# Altium schematic sheet POWER.SchDoc
size 299 x 210 mm; PageSetup: Record=PageOptions|CenterHorizontal=True|CenterVertical=True|PrintScale=0.94|XCorrection=0.00|YCorrection=0.00|PrintKind=0|BorderSize=5000000|LeftOffset=0|BottomOffset=0|Orientation=2|PaperLength=1000|PaperWidth=1000|Scale=100|PaperSource=15|PrintQuality=600|MediaType=1|DitherType=10|PrintScaleMode=1|PaperKind=A4; Adr1: August Barks gata 6B; Adr2: SE-421 32 Västra Frölunda; Adr3: Sweden; Webpage: www.omnisys.se
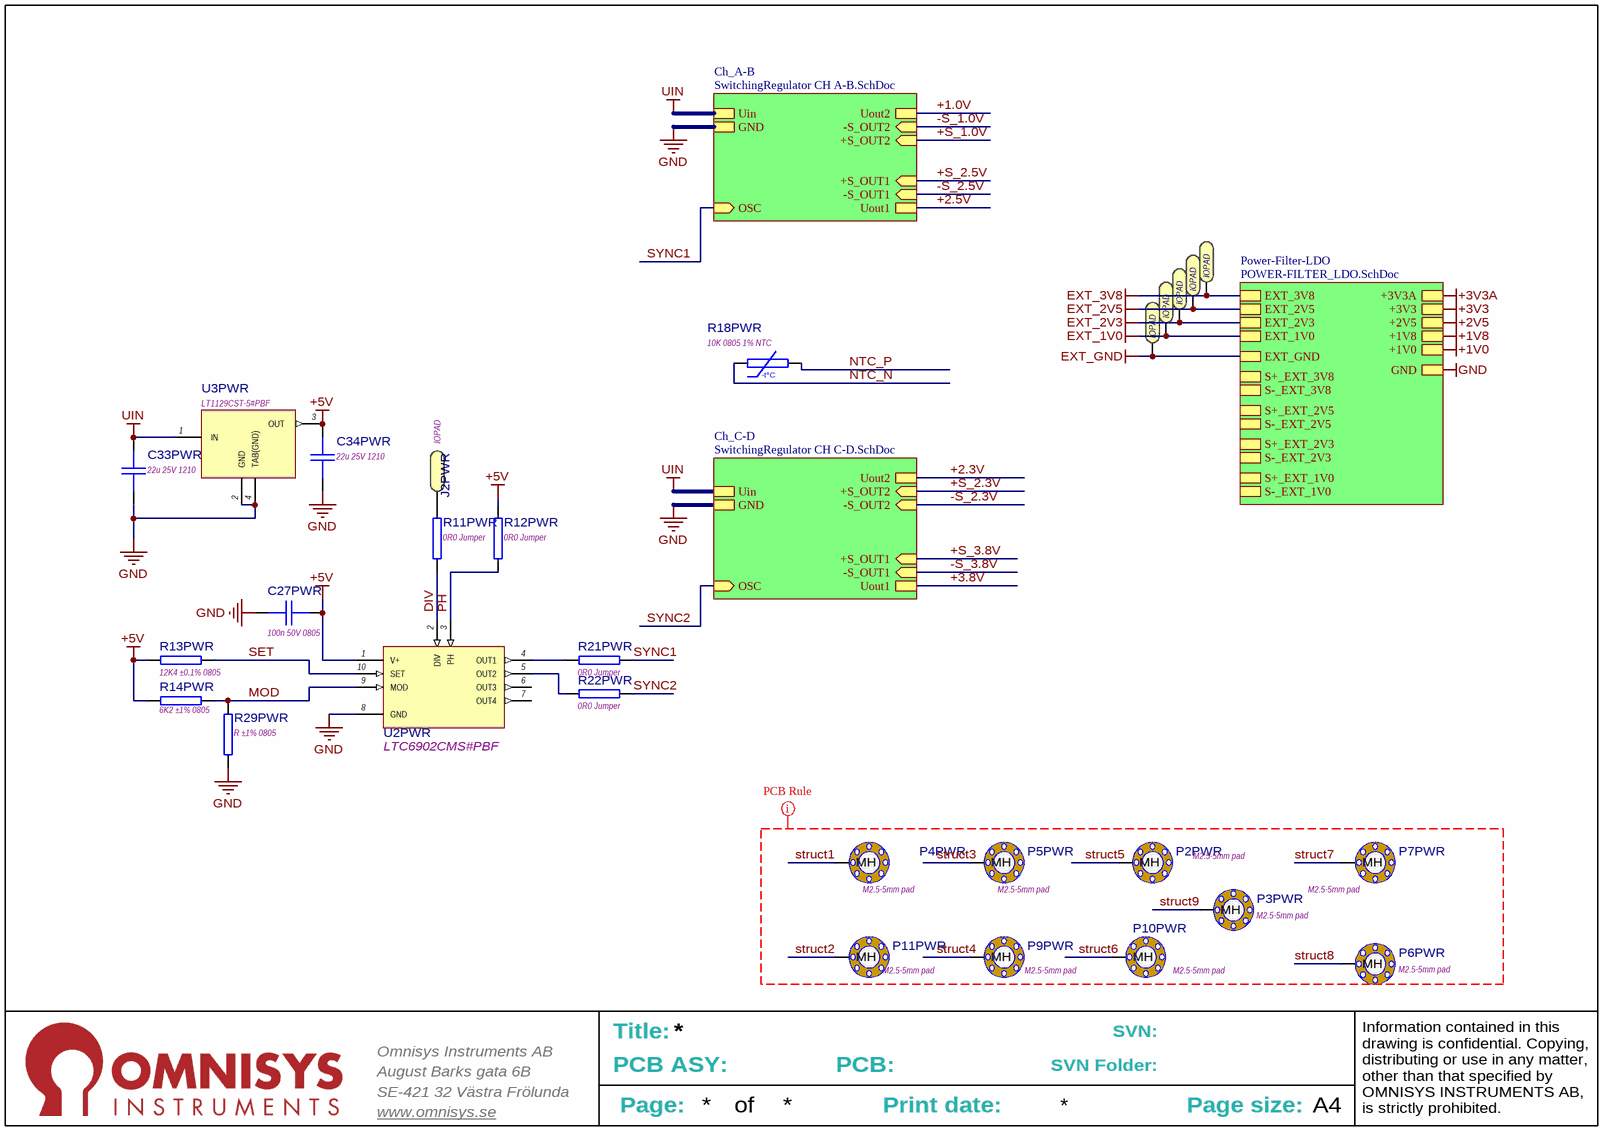
[diagram p0: POWER.SchDoc]

## Parts
C27PWR  100n 50V 0805  [CAPC2012X135N]
C33PWR  22u 25V 1210  [CAPC3225X270N]
C34PWR  22u 25V 1210  [CAPC3225X270N]
J2PWR  IOPAD  [SMT_IO_PAD_2x1MM]  (no BOM)
J16  IOPAD  [SMT_IO_PAD_2x1MM]  (no BOM)
J17  IOPAD  [SMT_IO_PAD_2x1MM]  (no BOM)
J18  IOPAD  [SMT_IO_PAD_2x1MM]  (no BOM)
J19  IOPAD  [SMT_IO_PAD_2x1MM]  (no BOM)
J20  IOPAD  [SMT_IO_PAD_2x1MM]  (no BOM)
P2PWR  M2.5-5mm pad  [MH5-2_7MM]  (no BOM)
P3PWR  M2.5-5mm pad  [MH5-2_7MM]  (no BOM)
P4PWR  M2.5-5mm pad  [MH5-2_7MM]  (no BOM)
P5PWR  M2.5-5mm pad  [MH5-2_7MM]  (no BOM)
P6PWR  M2.5-5mm pad  [MH5-2_7MM]  (no BOM)
P7PWR  M2.5-5mm pad  [MH5-2_7MM]  (no BOM)
P9PWR  M2.5-5mm pad  [MH5-2_7MM]  (no BOM)
P10PWR  M2.5-5mm pad  [MH5-2_7MM]  (no BOM)
P11PWR  M2.5-5mm pad  [MH5-2_7MM]  (no BOM)
R11PWR  0R0 Jumper  [RESC2012N]
R12PWR  0R0 Jumper  [RESC2012N]
R13PWR  12K4 ±0.1% 0805  [RESC2012N]
R14PWR  6K2 ±1% 0805  [RESC2012N]
R18PWR  10K 0805 1% NTC  [RESC2012N]
R21PWR  0R0 Jumper  [RESC2012N]
R22PWR  0R0 Jumper  [RESC2012N]
R29PWR  R ±1% 0805  [RESC2012N]
U2PWR  LTC6902CMS#PBF  [TSSOP50P490X110-10N]
U3PWR  LT1129CST-5#PBF  [SOT230P700X180-4N]

## Sub-sheets
Ch_A-B = SwitchingRegulator CH A-B.SchDoc: Uout2, Uout1, Uin, OSC (in), GND, +S_OUT1 (in), -S_OUT1 (in), +S_OUT2 (in), -S_OUT2 (in)
Ch_C-D = SwitchingRegulator CH C-D.SchDoc: Uout2, Uout1, Uin, OSC (in), GND, +S_OUT1 (in), -S_OUT1 (in), +S_OUT2 (in), -S_OUT2 (in)
Power-Filter-LDO = POWER-FILTER_LDO.SchDoc: +3V3, EXT_3V8, +1V8, EXT_2V3, EXT_1V0, EXT_2V5, +1V0, +2V5, GND, +3V3A, S+_EXT_1V0, S-_EXT_1V0, S+_EXT_2V5, S-_EXT_2V5, S+_EXT_3V8, S-_EXT_3V8, S-_EXT_2V3, S+_EXT_2V3, EXT_GND

## Nets
+1V0: sheet Power-Filter-LDO/+1V0
+1V8: sheet Power-Filter-LDO/+1V8
+2V5: sheet Power-Filter-LDO/+2V5
+3V3: sheet Power-Filter-LDO/+3V3
+3V3A: sheet Power-Filter-LDO/+3V3A
+5V: C27PWR.1 C34PWR.1 R12PWR.1 R13PWR.2 R14PWR.2 U2PWR.1(V+) U3PWR.3(OUT)
EXT_1V0: J19.1 ; sheet Power-Filter-LDO/EXT_1V0
EXT_2V3: J18.1 ; sheet Power-Filter-LDO/EXT_2V3
EXT_2V5: J17.1 ; sheet Power-Filter-LDO/EXT_2V5
EXT_3V8: J16.1 ; sheet Power-Filter-LDO/EXT_3V8
EXT_GND: J20.1 ; sheet Power-Filter-LDO/EXT_GND
GND: C27PWR.2 C33PWR.2 C34PWR.2 R29PWR.1 U2PWR.8(GND) U3PWR.2(GND) U3PWR.4(TAB(GND)) ; sheet Ch_A-B/GND, sheet Ch_C-D/GND, sheet Power-Filter-LDO/GND
UIN: C33PWR.1 U3PWR.1(IN) ; sheet Ch_A-B/Uin, sheet Ch_C-D/Uin
+1.0V: sheet Ch_A-B/Uout2
+2.3V: sheet Ch_C-D/Uout2
+2.5V: sheet Ch_A-B/Uout1
+3.8V: sheet Ch_C-D/Uout1
+S_1.0V: sheet Ch_A-B/+S_OUT2
+S_2.3V: sheet Ch_C-D/+S_OUT2
+S_2.5V: sheet Ch_A-B/+S_OUT1
+S_3.8V: sheet Ch_C-D/+S_OUT1
-S_1.0V: sheet Ch_A-B/-S_OUT2
-S_2.3V: sheet Ch_C-D/-S_OUT2
-S_2.5V: sheet Ch_A-B/-S_OUT1
-S_3.8V: sheet Ch_C-D/-S_OUT1
DIV: R11PWR.2 U2PWR.2(DIV)
MOD: R14PWR.1 R29PWR.2 U2PWR.9(MOD)
NTC_N: R18PWR.1
NTC_P: R18PWR.2
PH: R12PWR.2 U2PWR.3(PH)
SET: R13PWR.1 U2PWR.10(SET)
struct1: P4PWR.MH
struct2: P11PWR.MH
struct3: P5PWR.MH
struct4: P9PWR.MH
struct5: P2PWR.MH
struct6: P10PWR.MH
struct7: P7PWR.MH
struct8: P6PWR.MH
struct9: P3PWR.MH
SYNC1: R21PWR.2 ; sheet Ch_A-B/OSC
SYNC2: R22PWR.2 ; sheet Ch_C-D/OSC
NetJ2PWR_1: J2PWR.1 R11PWR.1
NetR21PWR_1: R21PWR.1 U2PWR.4(OUT1)
NetR22PWR_1: R22PWR.1 U2PWR.5(OUT2)

Not connected (* = marked no-connect by the designer): U2PWR 6(OUT3) 7(OUT4)

## Layout directives
rule Routing Via Style [Pref Size = 1mm    Pref Hole Size = 0.5mm]: struct1, struct2, struct3, struct4, struct5, struct6, struct7, struct8, struct9

## Notes on the sheet
- August Barks gata 6B
- Omnisys Instruments AB
- Title:
- PCB ASY:
- PCB:
- SVN:
- SVN Folder:
- SE-421 32 Västra Frölunda
- www.omnisys.se
- Page:
- of
- Print date:
- Page size:
- A4
- Information contained in this drawing is confidential. Copying, distributing or use in any matter, other than that specified by OMNISYS INSTRUMENTS AB, is strictly prohibited.
- (in symbol CMP-1800-003166-1) -t°C

## Library data of the parts
C27PWR = CMP-0300-002346-3: 100n 50V X7R ±10% 0805 (2012 metric); PartNumber: GRM21BR71H104KA01; Capacitance: 100nF; Tolerance: 10%; Package: 2012/0805; Rated Voltage: 50V; Temperature Charateristics: X7R; Thickness: 1.35mm
C33PWR C34PWR = CMP-0300-000360-1: 22u 25V X7R ±10% 1210 (3225 metric); partnumber: GRM32ER71E226ME15; Capacitance: 22µF; LatestRevision: 1; ReleaseDateNum: 42433.5235168866; Tolerance: 10%; Cat: 25V; CreatedAt: 04/03/2016 12:33:50 PM; FootprintDescription1: Chip Capacitor, 2-Leads, Body 3,2x2,5mm, IPC Medium Density; FootprintDescription2: Chip Capacitor, 2-Leads, Body 3,2x2,5mm, IPC Low Density; FootprintDescription3: Chip Capacitor, 2-Leads, Body 3,2x2,5mm, IPC High Density; FootprintName1: CAPC3225X270N; FootprintName2: CAPC3225X270M; FootprintName3: CAPC3225X270L; FootprintRevisionID1: PCC-00143-1; FootprintRevisionID2: PCC-00142-1; FootprintRevisionID3: PCC-00141-1; Package: 3225/1210; Rated Voltage: 25V; Rated Voltgae: 25V; Temperature Charateristics: X7R; Thickness: 2.7mm
J2PWR J16-J20 = CMP-1000-000152-4: IO pad used for test points and flying leads.
P2PWR P3PWR P4PWR P5PWR P6PWR P7PWR P9PWR P10PWR P11PWR = CMP-1600-000010-2: Mounting hole, M2.5-5mm pad
R11PWR R12PWR R21PWR R22PWR = CMP-1800-000000-3: 0R0 Jumper 150V 0805 (2012 metric) Max 2.5A; Value: 0; Tolerance: 0%; Power: 0W; Case-EIA: 0805; Case-Metric: 2012; Temp. Coefficent: 0%; Maximum working voltage: 150V; Technology: SMT
R13PWR = CMP-1800-001171-1: 12K4 ±0.1% ±10 ppm/˚C 0.1W 100V 0805 (2012 metric) Thinfilm; Value: 12400.00; Temp. Coefficent: 10; Tolerance: ±0.1; Case-EIA: 0805; Case-Metric: 2012; Maximum working voltage: 100V; Power: 0.1W; Technology: SMT
R14PWR = CMP-1800-000092-3: 6K2 ±1% ±100 ppm/˚C 0.125W 150V 0805 (2012 metric); Value: 6.2k; Power: 125mW; Temp. Coefficent: 0.01%; Case-EIA: 0805; Case-Metric: 2012; Tolerance: 1%; Maximum working voltage: 150V; Technology: SMT
R18PWR = CMP-1800-003166-1: 10K NTC resistor 1%  0805 (2012 metric); PartNumber: NTCS0805E3103FLT; Case-EIA: 0805; Case-Metric: 2012
R29PWR = CMP-1800-003155-2: R ±1% 0.125W 150V 0805 (2012 metric); Case-EIA: 0805; Case-Metric: 2012; Power: 125mW; Temp. Coefficent: 0%; Value: 10G; Maximum working voltage: 150V; Tolerance: 0%; Technology: SMT
U2PWR = CMP-2100-000530-1: LINEAR TECHNOLOGY         LTC6902CMS#PBF            OSCILLATOR, 5KHZ - 20MHZ, 10MSOP; Max Supply Voltage: 5.5V; Min Supply Voltage: 2.7V; Operating Supply Current: 2.5mA; PartNumber: LTC6902CMS#PBF; Case/Package: MSOP; Depth: 3mm; Frequency: 20MHz; Height: 0.86mm; Lead Free: Lead Free; Length: 3mm; Max Operating Temperature: 85°C; Min Operating Temperature: -40°C; Mount: Surface Mount; Number of Pins: 10; Package Quantity: 50; Packaging: Rail/Tube; Radiation Hardening: No; REACH SVHC: No SVHC; Width: 3mm
U3PWR = CMP-2100-000268-1: 700mA, Micropower Low Dropout Regulators, LT1129CST-5#PBF; Input Voltage max: 30V; Output Voltage: 3.8V to 30V; Vdo: 400mV; Output current: 700mA; Case: SOT-223